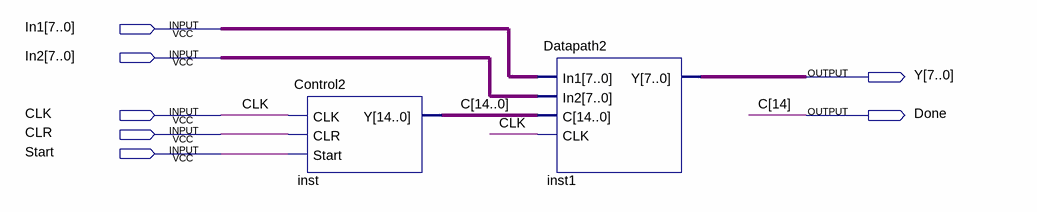
[diagram p0: schematic sheet]
// Quartus schematic BaiTap.bdf as structural Verilog: 2 symbols, 7 pins
module BaiTap (
  input  [7:0] In1,
  input  [7:0] In2,
  input  CLK,
  input  CLR,
  input  Start,
  output [7:0] Y,
  output Done
);

  wire [13:0] C;

  Control2 inst (.CLK(CLK), .CLR(CLR), .Start(Start), .Y({Done, C}));
  Datapath2 inst1 (.In1(In1), .In2(In2), .C({Done, C}), .CLK(CLK), .Y(Y));

  // Other names for the same wires on the sheet: C[14] = Done
endmodule
